# EAGLE design air-quality-kit (EAGLE 9.5.1)
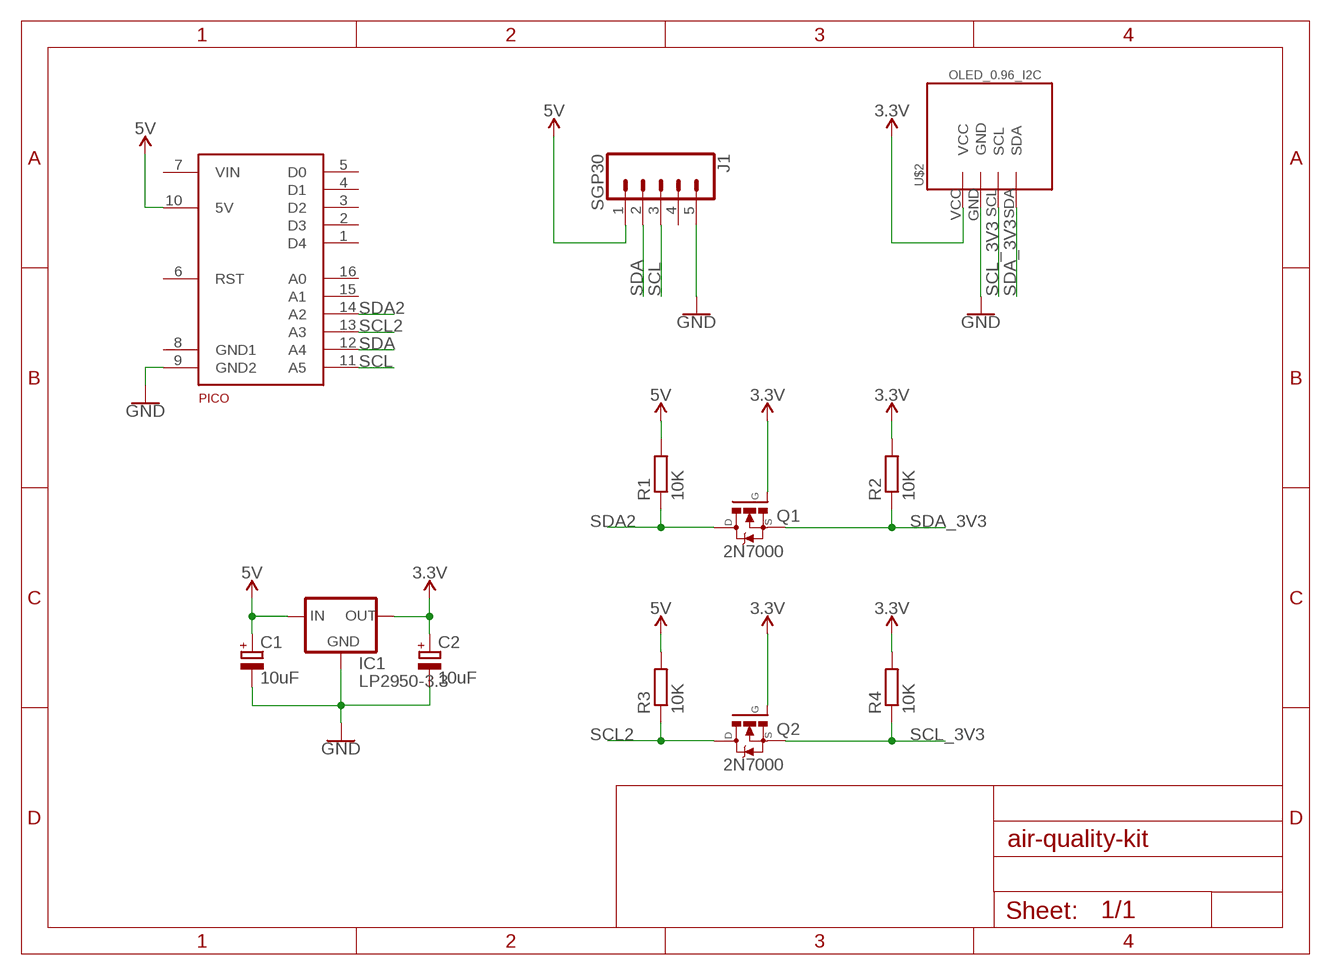
[diagram p0: schematic, sheet 1]

## Parts
C1  10uF  CPOL-EUE2.5-5  [E2,5-5]
C2  10uF  CPOL-EUE2.5-5  [E2,5-5]
IC1  LP2950-3.3  LP2950ACZ-3.3  [TO92]
J1  SGP30  CONN_05  [1X05]
PICO  PICO  [PICO]
Q1  2N7000  [TO-92]
Q2  2N7000  [TO-92]
R1  10K  R-EU_0207/10  [0207/10]
R2  10K  R-EU_0207/10  [0207/10]
R3  10K  R-EU_0207/10  [0207/10]
R4  10K  R-EU_0207/10  [0207/10]
U$2  OLED_0.96_I2C  [OLED_0.96_I2C]

## Nets
3.3V: C2.+ IC1.1(OUT) Q1.2(G) Q2.2(G) R2.2 R4.2 U$2.VCC
5V: C1.+ IC1.3(IN) J1.1 PICO.10(5V) R1.2 R3.2
GND: C1.- C2.- IC1.2(GND) J1.5 PICO.9(GND2) U$2.GND
SCL: J1.3 PICO.11(A5)
SCL2: PICO.13(A3) Q2.3(D) R3.1
SCL_3V3: Q2.1(S) R4.1 U$2.SCL
SDA: J1.2 PICO.12(A4)
SDA2: PICO.14(A2) Q1.3(D) R1.1
SDA_3V3: Q1.1(S) R2.1 U$2.SDA
Unconnected: J1.4 PICO.1(D4) PICO.2(D3) PICO.3(D2) PICO.4(D1) PICO.5(D0) PICO.6(RST) PICO.7(VIN) PICO.8(GND1) PICO.15(A1) PICO.16(A0)

## Library data of the parts
C1 C2 = rcl:CPOL-EU: POLARIZED CAPACITOR, European symbol; SPICEPREFIX: C
IC1 = v-reg:LP2950?*: Source: http://cache.national.com/ds/LP/LP2950.pdf
J1 = SparkFun-Connectors:CONN_05: Multi connection point. Often used as Generic Header-pin footprint for 0.1 inch spaced/style header connections On any of the 0.1 inch spaced packages, you can populate with these: Break Away Headers - Straight <https://www.sparkfun.com/products/116> (PRT-00116) Break Away Male Headers - Right Angle <https://www.sparkfun.com/products/553> (PRT-00553) Female Headers <https://www.sparkfun.com/products/115> (PRT-00115) Break Away Headers - Machine Pin <https://www.sparkfun.com/products/117> (PRT-00117) Break Away Female Headers - Swiss Machine Pin <https://www.sparkfun.com/products/743> (PRT-00743) For SCREWTERMINALS and SPRING TERMINALS visit here: Screw Terimnals on SparkFun.com <https://www.sparkfun.com/search/results?term=Screw+Terminals> (5mm/3.5mm/2.54mm spacing) This device is also useful as a general connection point to wire up your design to another part of your project. Our various solder wires solder well into these plated through hole pads. Hook-Up Wire - Assortment (Stranded, 22 AWG) <https://www.sparkfun.com/products/11375> (PRT-11375) Hook-Up Wire - Assortment (Solid Core, 22 AWG) <https://www.sparkfun.com/products/11367> (PRT-11367) View the entire wire category on our website here <https://www.sparkfun.com/categories/141> Special notes: Molex polarized connector foot print use with SKU : PRT-08231 with associated crimp pins and housings. 1MM SMD Version SKU: PRT-10208
PICO = Frenoy_Custom:PICO
Q1 Q2 = 2N7000:2N7000: N-Channel MOSFET; AVAILABILITY: Unavailable; DESCRIPTION: 2N7000; MF: STMicroelectronics; MP: 2N7000; PACKAGE: TO-92 ON Semiconductor; PRICE: None
R1-R4 = rcl:R-EU_: RESISTOR, European symbol; SPICEPREFIX: R
U$2 = tft_1_8_1_44_oled_0_96:OLED_0.96_I2C

## Board
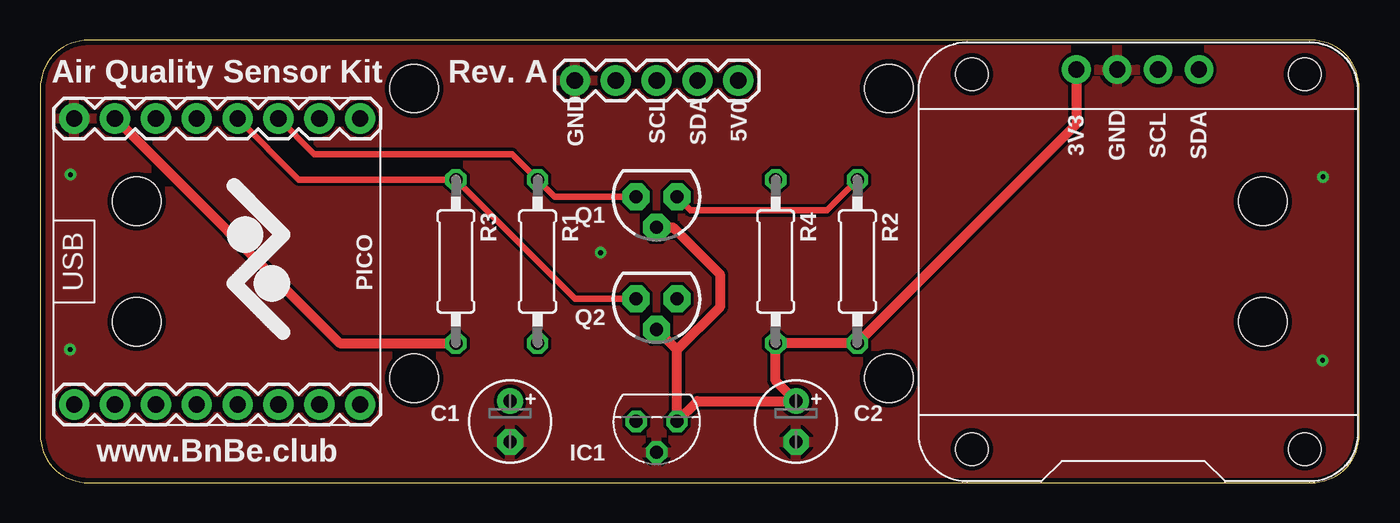
[diagram p1: board, top side]
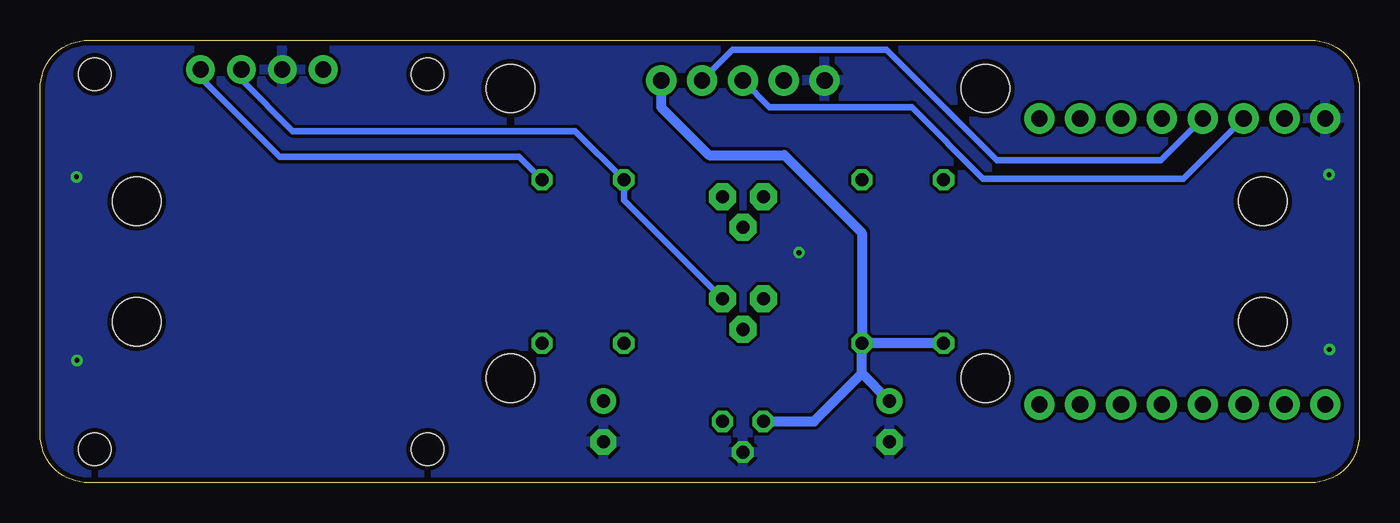
[diagram p2: board, bottom side, seen from below]

Size 82 x 27.5 mm. Coordinates in mm from the lower left corner, seen from the top.
Outline: 79,27.5 3,27.5 arc90 0,24.5 0,3 arc90 3,0 79,0 arc90 82,3 82,24.5 arc90 79,27.5
Copper layers (1*16): Top 0.035mm / dielectric 1.5mm / Bottom 0.035mm
Design rules "JLPCB_2L_Recommended_Use_this": minimum track width 8mil, minimum drill 0.3mm, track to track 8mil, track to pad 8mil, pad to pad 8mil, via to via 8mil, smd to smd 8mil, copper to edge 12mil, drill to drill 6mil, minimum pad ring 10mil, minimum via ring 8mil, stop-mask expansion 4mil, vias tented up to drill 20mil, thermal gap 10mil
Holes 3 mm at 6,17.5 6,10 23.25,24.5 52.75,24.5 52.75,6.5 23.25,6.5 76,17.5 76,10

### Footprints (pad centres in the part's own frame; a part is rotated, then mirrored left to right if it is on the bottom)
E2,5-5 = drill 0.813 pad 1.6: + -1.27,0 | drill 0.813 pad 1.6 octagon: - 1.27,0
TO92 = drill 0.813 octagon: 1 -1.27,0; 2 0,1.905; 3 1.27,0
1X05 = drill 1.016 pad 1.88: 1 0,0; 2 2.54,0; 3 5.08,0; 4 7.62,0; 5 10.16,0
PICO = drill 1.016 pad 1.88: 1 -8.89,-8.89; 2 -8.89,-6.35; 3 -8.89,-3.81; 4 -8.89,-1.27; 5 -8.89,1.27; 6 -8.89,3.81; 7 -8.89,6.35; 8 -8.89,8.89; 9 8.89,8.89; 10 8.89,6.35; 11 8.89,3.81; 12 8.89,1.27; 13 8.89,-1.27; 14 8.89,-3.81; 15 8.89,-6.35; 16 8.89,-8.89
TO-92 = drill 0.813 pad 1.676 octagon: 1 -1.27,0; 2 0,1.905; 3 1.27,0
0207/10 = drill 0.813 octagon: 1 -5.08,0; 2 5.08,0
OLED_0.96_I2C = drill 1 pad 1.778: GND -1.63,11.63; SCL 0.91,11.63; SDA 3.45,11.63; VCC -4.17,11.63 | hole 2: -10.67,-11.97; 10.03,-11.97; 10.03,11.33; -10.67,11.33

### Placement (x,y rotation side)
C1  29.21,3.81 270 top
C2  46.99,3.81 270 top
IC1  38.32,3.81 180 top
J1  43.4,25 180 top
PICO  11,13.75 90 top
Q1  38.32,17.78 180 top
Q2  38.32,11.43 180 top
R1  30.92,13.75 270 top
R2  50.8,13.75 270 top
R3  25.84,13.75 270 top
R4  45.72,13.75 270 top
U$2  68.58,14.05 0 top

### Tracks (layer width: path | path; a pad name or v marks a point on that pad's centre or on a via)
3.3V
  Top 0.61: U$2.VCC 64.41,22.28 R2.2 R4.2 45.72,6.35 C2.+ 40.86,5.08 IC1.1 39.59,8.26 | 39.59,8.26 Q2.2 | Q1.2 39.34,15.88 42.25,12.96 42.25,10.92 39.59,8.26
5V
  Top 0.61: PICO.10 18.62,8.67 R3.2
  Bottom 0.61: R3.2 R1.2 | C1.+ 30.92,6.79 | 30.92,6.79 R1.2 | IC1.3 33.9,3.81 30.92,6.79 | J1.1 43.4,23.35 40.41,20.36 35.75,20.36 30.92,15.53 R1.2
GND  (via drill 0.3)
  other vias: 34.83,14.3 79.74,19.01 79.72,7.6 1.88,19.15 1.86,8.29
  pour Top: -0.09,27.62 81.93,27.62 81.93,-0.57 -0.11,-0.57 -0.11,27.64
  pour Bottom: 0.09,27.81 82.11,27.81 82.11,-0.39 0.08,-0.39 0.08,27.83
SCL
  Bottom 0.406: PICO.11 10.93,18.91 23.39,18.91 27.82,23.34 36.66,23.34 J1.3
SCL2
  Top 0.406: Q2.3 33.24,11.43 R3.1 16.08,18.83 PICO.13
SCL_3V3
  Bottom 0.406: U$2.SCL 69.49,25.04 66.31,21.86 48.75,21.86 R4.1 45.72,17.56 Q2.1
SDA
  Bottom 0.406: PICO.12 12.34,20.04 22.52,20.04 29.39,26.91 38.95,26.91 J1.2
SDA2
  Top 0.406: Q1.3 31.97,17.78 R1.1 29.32,20.43 17.02,20.43 PICO.14
SDA_3V3
  Top 0.406: Q1.1 40.44,16.93 48.9,16.93 R2.1
  Bottom 0.406: U$2.SDA 72.03,25.18 67.12,20.27 52.24,20.27 R2.1

### Text on the board
tPlace: Air Quality Sensor Kit | Rev. A | www.BnBe.club
tNames: GND | SCL | SDA | 5V0 | 3V3 | GND | SCL | SDA